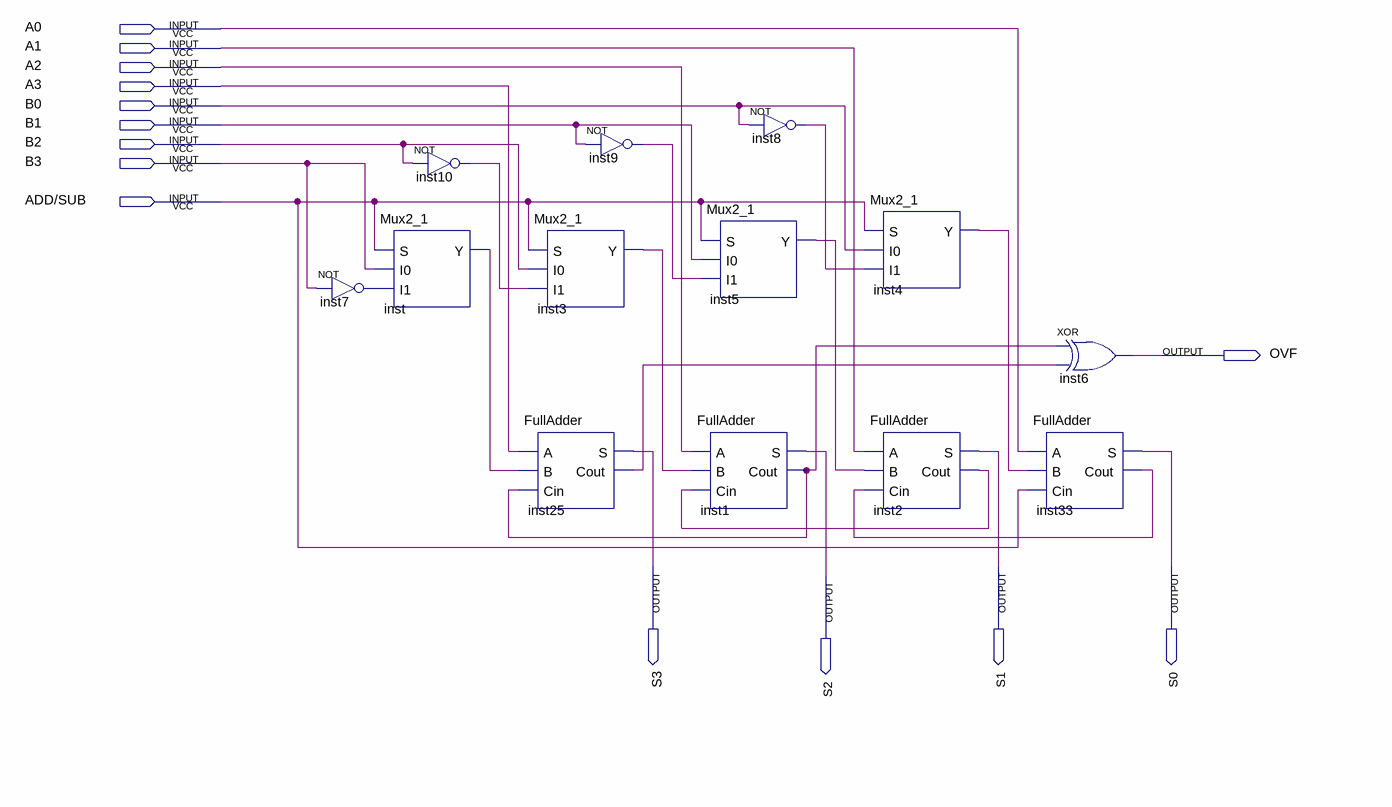
[diagram p0: schematic sheet]
// Quartus schematic AddSubDemo.bdf as structural Verilog: 13 symbols, 14 pins
module AddSubDemo (
  input  A0,
  input  A1,
  input  A2,
  input  A3,
  input  B0,
  input  B1,
  input  B2,
  input  B3,
  input  \ADD/SUB ,
  output OVF,
  output S3,
  output S1,
  output S0,
  output S2
);

  wire inst1_cout, inst2_cout, inst3_y, inst4_y, inst5_y, inst7_out, inst8_out, inst9_out, inst10_out,
       inst25_cout, inst33_cout, inst_y;

  not inst7 (inst7_out, B3);
  not inst10 (inst10_out, B2);
  Mux2_1 inst (.S(\ADD/SUB ), .I0(B3), .I1(inst7_out), .Y(inst_y));
  not inst9 (inst9_out, B1);
  Mux2_1 inst3 (.S(\ADD/SUB ), .I0(B2), .I1(inst10_out), .Y(inst3_y));
  FullAdder inst25 (.A(A3), .B(inst_y), .Cin(inst1_cout), .S(S3), .Cout(inst25_cout));
  Mux2_1 inst5 (.S(\ADD/SUB ), .I0(B1), .I1(inst9_out), .Y(inst5_y));
  FullAdder inst1 (.A(A2), .B(inst3_y), .Cin(inst2_cout), .S(S2), .Cout(inst1_cout));
  not inst8 (inst8_out, B0);
  Mux2_1 inst4 (.S(\ADD/SUB ), .I0(B0), .I1(inst8_out), .Y(inst4_y));
  FullAdder inst2 (.A(A1), .B(inst5_y), .Cin(inst33_cout), .S(S1), .Cout(inst2_cout));
  FullAdder inst33 (.A(A0), .B(inst4_y), .Cin(\ADD/SUB ), .S(S0), .Cout(inst33_cout));
  xor inst6 (OVF, inst1_cout, inst25_cout);
endmodule
